# EAGLE design OneDigitDisplay (EAGLE 9.6.2)
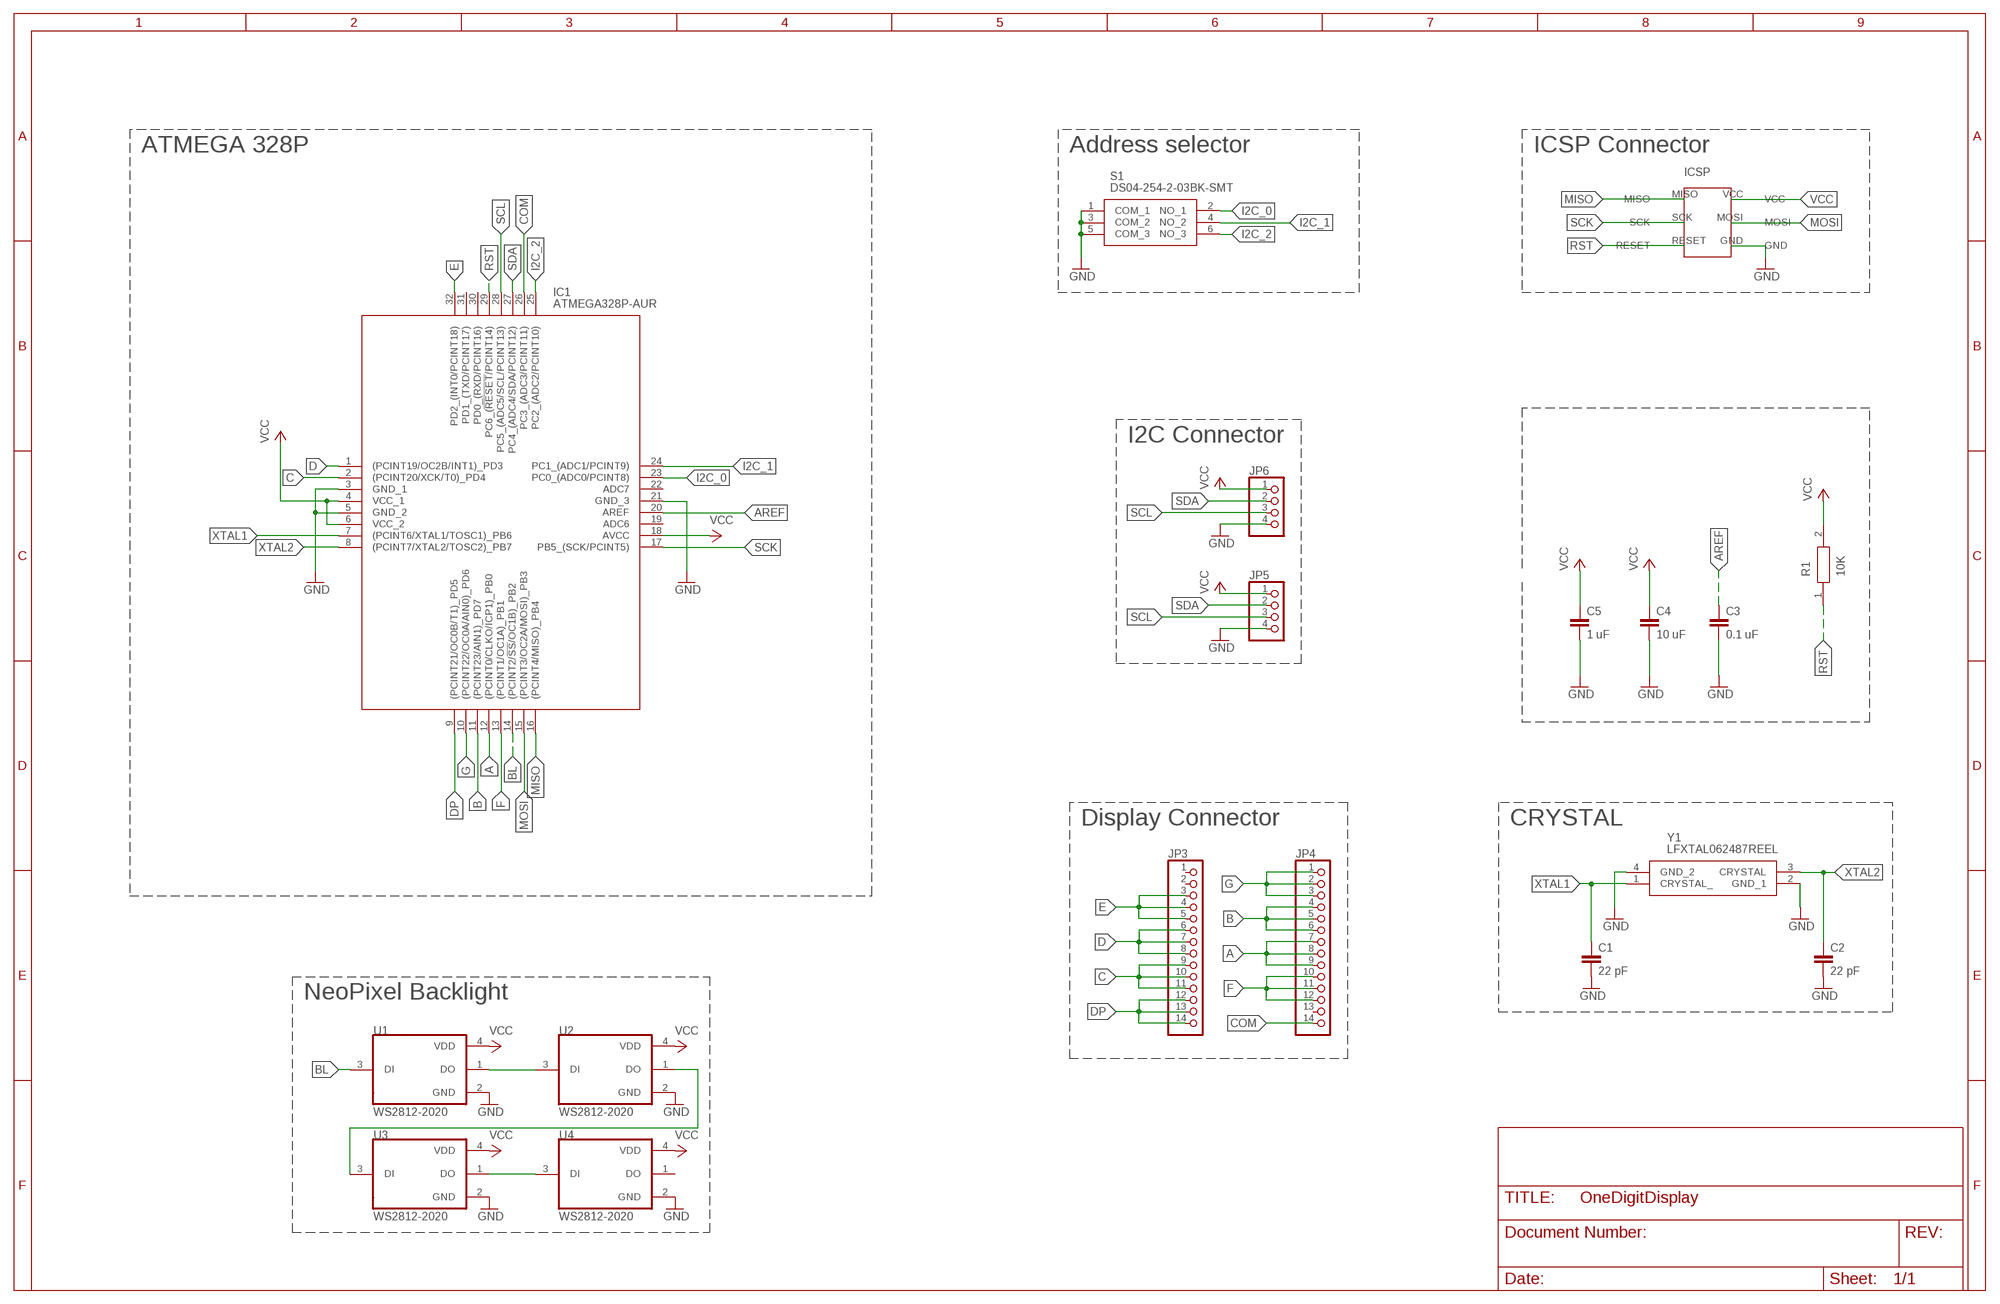
[diagram p0: schematic, sheet 1]

## Parts
C1  22 pF  C-EUC0603K  [C0603K]
C2  22 pF  C-EUC0603K  [C0603K]
C3  0.1 uF  C-EUC0603  [C0603]
C4  10 uF  C-EUC0603  [C0603]
C5  1 uF  C-EUC0603  [C0603]
IC1  ATMEGA328P-AUR  [QFP80P900X900X120-32N]
JP3  PINHD-1X14  [1X14]
JP4  PINHD-1X14  [1X14]
JP5  PINHD-1X4  [1X04]
JP6  PINHD-1X4  [1X04]
R1  10K  TNPW060330K0BXEA  [RESC1608X55N]
S1  DS04-254-2-03BK-SMT  [DS04254203BKSMT]
U1  WS2812-2020  [LED_WS2812-2020]
U2  WS2812-2020  [LED_WS2812-2020]
U3  WS2812-2020  [LED_WS2812-2020]
U4  WS2812-2020  [LED_WS2812-2020]
U$1  6PINICSP  [6PINICSP]
Y1  LFXTAL062487REEL  [LFXTAL062487REEL]

## Nets
A: IC1.12((PCINT0/CLKO/ICP1)_PB0) JP4.7 JP4.8 JP4.9
AREF: C3.1 IC1.20(AREF)
B: IC1.11((PCINT23/AIN1)_PD7) JP4.4 JP4.5 JP4.6
BL: IC1.14((PCINT2/!SS!/OC1B)_PB2) U1.3(DI)
C: IC1.2((PCINT20/XCK/T0)_PD4) JP3.9 JP3.10 JP3.11
COM: IC1.26(PC3_(ADC3/PCINT11)) JP4.14
D: IC1.1((PCINT19/OC2B/INT1)_PD3) JP3.6 JP3.7 JP3.8
DP: IC1.9((PCINT21/OC0B/T1)_PD5) JP3.12 JP3.13 JP3.14
E: IC1.32(PD2_(INT0/PCINT18)) JP3.3 JP3.4 JP3.5
F: IC1.13((PCINT1/OC1A)_PB1) JP4.10 JP4.11 JP4.12
G: IC1.10((PCINT22/OC0A/AIN0)_PD6) JP4.1 JP4.2 JP4.3
GND: C1.2 C2.2 C3.2 C4.2 C5.2 IC1.3(GND_1) IC1.5(GND_2) IC1.21(GND_3) JP5.4 JP6.4 S1.1(COM_1) S1.3(COM_2) S1.5(COM_3) U1.2(GND) U2.2(GND) U3.2(GND) U4.2(GND) U$1.GND Y1.2(GND_1) Y1.4(GND_2)
I2C_0: IC1.23(PC0_(ADC0/PCINT8)) S1.2(NO_1)
I2C_1: IC1.24(PC1_(ADC1/PCINT9)) S1.4(NO_2)
I2C_2: IC1.25(PC2_(ADC2/PCINT10)) S1.6(NO_3)
MISO: IC1.16((PCINT4/MISO)_PB4) U$1.MISO
MOSI: IC1.15((PCINT3/OC2A/MOSI)_PB3) U$1.MOSI
N$1: U1.1(DO) U2.3(DI)
N$2: U2.1(DO) U3.3(DI)
N$3: U3.1(DO) U4.3(DI)
RST: IC1.29(PC6_(!RESET!/PCINT14)) R1.1 U$1.RESET
SCK: IC1.17(PB5_(SCK/PCINT5)) U$1.SCK
SCL: IC1.28(PC5_(ADC5/SCL/PCINT13)) JP5.3 JP6.3
SDA: IC1.27(PC4_(ADC4/SDA/PCINT12)) JP5.2 JP6.2
VCC: C4.1 C5.1 IC1.4(VCC_1) IC1.6(VCC_2) IC1.18(AVCC) JP5.1 JP6.1 R1.2 U1.4(VDD) U2.4(VDD) U3.4(VDD) U4.4(VDD) U$1.VCC
XTAL1: C1.1 IC1.7((PCINT6/XTAL1/TOSC1)_PB6) Y1.1(CRYSTAL_)
XTAL2: C2.1 IC1.8((PCINT7/XTAL2/TOSC2)_PB7) Y1.3(CRYSTAL)
Unconnected: IC1.19(ADC6) IC1.22(ADC7) IC1.30(PD0_(RXD/PCINT16)) IC1.31(PD1_(TXD/PCINT17)) JP3.1 JP3.2 JP4.13 U4.1(DO)

## Notes on the sheet
- ATMEGA 328P | Address selector | ICSP Connector
- I2C Connector
- Display Connector | CRYSTAL
- NeoPixel Backlight

## Library data of the parts
C1-C5 = rcl:C-EU: CAPACITOR, European symbol; SPICEPREFIX: C
IC1 = ATMEGA328P-AUR:ATMEGA328P-AUR: 8-bit Microcontrollers - MCU AVR 32K FLSH 2K SRAM 1KB EE-20MHz IND Source: Datasheet; DESCRIPTION: 8-bit Microcontrollers - MCU AVR 32K FLSH 2K SRAM 1KB EE-20MHz IND; HEIGHT: 1.2mm; MANUFACTURER_NAME: Microchip; MANUFACTURER_PART_NUMBER: ATMEGA328P-AUR; MOUSER_PART_NUMBER: 556-ATMEGA328P-AUR; MOUSER_PRICE-STOCK: https://www.mouser.co.uk/ProductDetail/Microchip-Technology/ATMEGA328P-AUR?qs=6Dg1WZIWLC4z32PdFaWSBQ%3D%3D
JP3 JP4 = adafruit:PINHD-1X14: PIN HEADER; SPICEPREFIX: X
JP5 JP6 = pinhead:PINHD-1X4: PIN HEADER
R1 = TNPW060330K0BXEA:TNPW060330K0BXEA: Thin Film Resistors - SMD TNPW0603 30K 0.1% T-10 ET1 e3 Source: Datasheet; DESCRIPTION: Thin Film Resistors - SMD TNPW0603 30K 0.1% T-10 ET1 e3; HEIGHT: 0.55mm; MANUFACTURER_NAME: Vishay; MANUFACTURER_PART_NUMBER: TNPW060330K0BXEA; MOUSER_PART_NUMBER: 71-TNPW060330K0BXEA; MOUSER_PRICE-STOCK: https://www.mouser.co.uk/ProductDetail/Vishay/TNPW060330K0BXEA?qs=vmHwEFxEFR%252BodANPEwSK8w%3D%3D
S1 = DS04-254-2-03BK-SMT:DS04-254-2-03BK-SMT: DIP Switches / SIP Switches DIP Switch, SPST, 2.54 pitch, flat actuator, SMT, 3 position, Black Source: Datasheet <https://datasheet.datasheetarchive.com/originals/distributors/Datasheets_SAMA/c6ff744c627a82ac82db8ce1595a468c.pdf>; DESCRIPTION: DIP Switches / SIP Switches DIP Switch, SPST, 2.54 pitch, flat actuator, SMT, 3 position, Black; HEIGHT: 4.3mm; MANUFACTURER_NAME: CUI Devices; MANUFACTURER_PART_NUMBER: DS04-254-2-03BK-SMT; MOUSER_PART_NUMBER: 490-DS04254203BK-SMT; MOUSER_PRICE-STOCK: https://www.mouser.co.uk/ProductDetail/CUI-Devices/DS04-254-2-03BK-SMT?qs=wnTfsH77Xs6HyisDGRVjIg%3D%3D
U1-U4 = WS2812-2020:WS2812-2020: Check availability <https://pricing.snapeda.com/parts/WS2812-2020/Worldsemi/view-part?ref=eda>; AVAILABILITY: Not in stock; DESCRIPTION: Intelligent control LED light source, SMD-4; MF: Worldsemi; MP: WS2812-2020; PACKAGE: Package; PRICE: None
U$1 = 6PINICSP:6PINICSP
Y1 = LFXTAL062487Reel:LFXTAL062487REEL: Crystals 16MHz 22pF -10C 60C Source: Datasheet <https://www.iqdfrequencyproducts.com/products/pn/LFXTAL062487Reel.pdf>; DESCRIPTION: Crystals 16MHz 22pF -10C 60C; HEIGHT: 0.6mm; MANUFACTURER_NAME: IQD; MANUFACTURER_PART_NUMBER: LFXTAL062487Reel; MOUSER_PART_NUMBER: 449-LFXTAL062487REEL; MOUSER_PRICE-STOCK: https://www.mouser.co.uk/ProductDetail/IQD/LFXTAL062487Reel?qs=e4%2FAndAAwgKTrG0QMc3CnQ%3D%3D

## Board
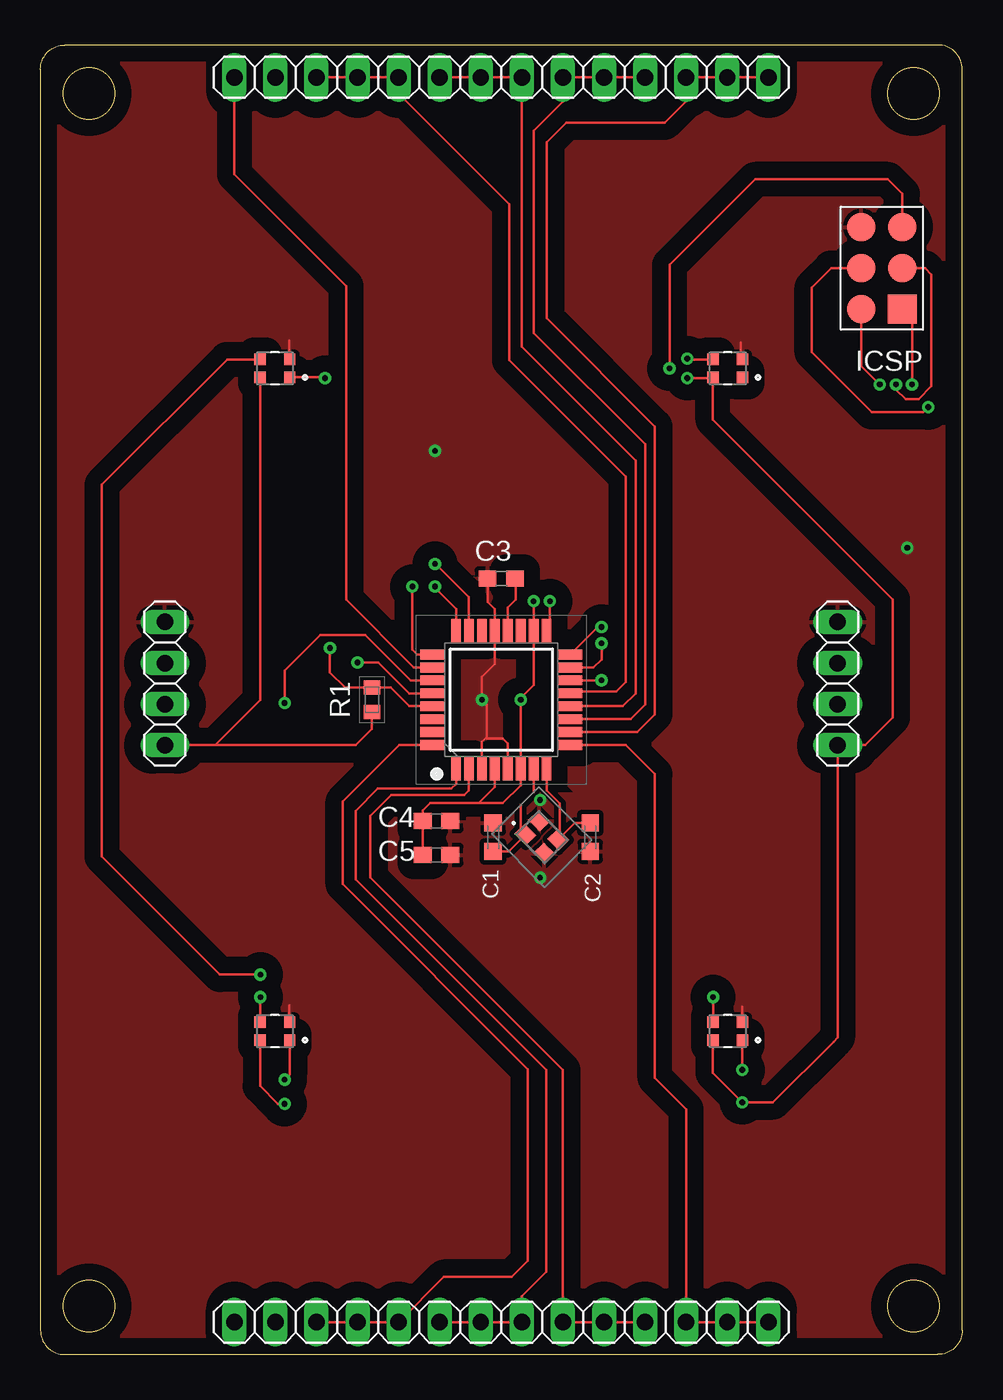
[diagram p1: board, top side]
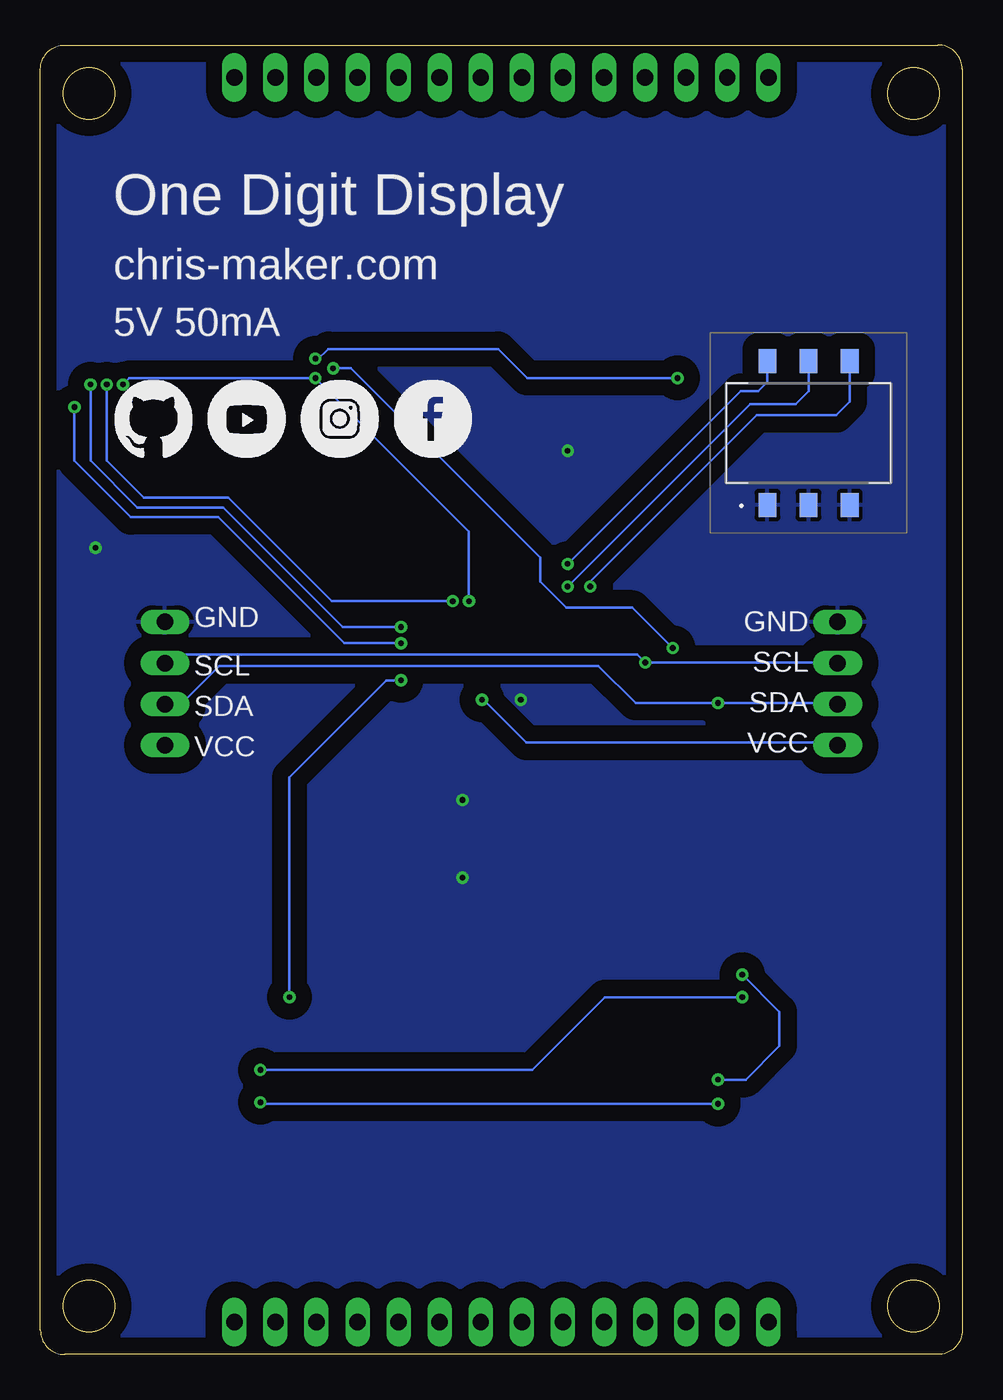
[diagram p2: board, bottom side, seen from below]

Size 57 x 81 mm. Coordinates in mm from the lower left corner, seen from the top.
Outline: 1.5,0 55.5,0 arc90 57,1.5 57,79.5 arc90 55.5,81 1.5,81 arc90 0,79.5 0,1.5 arc90 1.5,0
Outline: circle at 54,3 radius 1.6
Outline: circle at 3,3 radius 1.6
Outline: circle at 3,78 radius 1.6
Outline: circle at 54,78 radius 1.6
Copper layers (1*16): Top 0.035mm / dielectric 1.5mm / Bottom 0.035mm
Design rules "default": minimum track width 6mil, minimum drill 0.35mm, track to track 6mil, track to pad 6mil, pad to pad 6mil, via to via 6mil, smd to smd 6mil, copper to edge 40mil, drill to drill 6mil, minimum pad ring 10mil, minimum via ring 8mil, stop-mask expansion 4mil, vias tented up to drill 0mil, thermal gap 10mil

### Footprints (pad centres in the part's own frame; a part is rotated, then mirrored left to right if it is on the bottom)
C0603K = smd 1.05 x 1.08: 1 -0.875,0; 2 0.875,0
C0603 = smd 1.1 x 1: 1 -0.85,0; 2 0.85,0
QFP80P900X900X120-32N = smd 1.5 x 0.6: 1 -4.25,2.8; 2 -4.25,2; 3 -4.25,1.2; 4 -4.25,0.4; 5 -4.25,-0.4; 6 -4.25,-1.2; 7 -4.25,-2; 8 -4.25,-2.8; 17 4.25,-2.8; 18 4.25,-2; 19 4.25,-1.2; 20 4.25,-0.4; 21 4.25,0.4; 22 4.25,1.2; 23 4.25,2; 24 4.25,2.8 | smd 0.6 x 1.5: 9 -2.8,-4.25; 10 -2,-4.25; 11 -1.2,-4.25; 12 -0.4,-4.25; 13 0.4,-4.25; 14 1.2,-4.25; 15 2,-4.25; 16 2.8,-4.25; 25 2.8,4.25; 26 2,4.25; 27 1.2,4.25; 28 0.4,4.25; 29 -0.4,4.25; 30 -1.2,4.25; 31 -2,4.25; 32 -2.8,4.25
1X14 = drill 1.016 long: 1 -16.51,0; 2 -13.97,0; 3 -11.43,0; 4 -8.89,0; 5 -6.35,0; 6 -3.81,0; 7 -1.27,0; 8 1.27,0; 9 3.81,0; 10 6.35,0; 11 8.89,0; 12 11.43,0; 13 13.97,0; 14 16.51,0
1X04 = drill 1.016 long: 1 -3.81,0; 2 -1.27,0; 3 1.27,0; 4 3.81,0
RESC1608X55N = smd 0.85 x 1: 1 -0.75,0; 2 0.75,0
DS04254203BKSMT = smd 1.1 x 1.5: 1 -2.54,-4.45; 2 -2.54,4.45; 3 0,-4.45; 4 0,4.45; 5 2.54,-4.45; 6 2.54,4.45
LED_WS2812-2020 = smd 0.7 x 0.7: 1 0.915,-0.55; 2 0.915,0.55; 3 -0.915,0.55; 4 -0.915,-0.55
6PINICSP = smd 1.778 x 1.778: GND 2.54,2.54; MISO -2.54,0; MOSI 0,2.54; RESET 2.54,0; SCK 0,0; VCC -2.54,2.54
LFXTAL062487REEL = smd 1 x 0.9: 1 -0.825,-0.613; 2 0.825,-0.613; 3 0.825,0.613; 4 -0.825,0.613

### Placement (x,y rotation side)
C1  28,32 90 top
C2  34,32 270 top
C3  28.5,48 180 top
C4  24.5,33 0 top
C5  24.5,30.9 0 top
IC1  28.5,40.5 90 top
JP3  28.5,2 0 top
JP4  28.5,79 180 top
JP5  7.7,41.5 90 top
JP6  49.3,41.5 90 top
R1  20.5,40.5 270 top
S1  9.5,57 0 bottom
U1  42.5,20 0 top
U2  14.5,20 0 top
U3  14.5,61 0 top
U4  42.5,61 0 top
U$1  53.3,67.2 90 top
Y1  31,32 315 top

### Tracks (layer width: path | path; a pad name or v marks a point on that pad's centre or on a via)
A
  Top 0.152: JP4.9 JP4.8 JP4.7 29.77,62.33 36.8,55.3 36.8,40.9 36,40.1 IC1.12
AREF
  Top 0.152: C3.1 29.4,47.95 29.4,46.7 28.9,46.2 IC1.20
B
  Top 0.152: JP4.4 JP4.5 JP4.6 32.31,77.5 30.51,75.7 30.51,63.19 37.4,56.3 37.4,40.2 36.5,39.3 IC1.11
BL  (via drill 0.35)
  Top 0.152: v34.7,41.7 IC1.14 | v41.6,22.1 41.6,20.57 U1.3
  Bottom 0.152: v34.7,41.7 35.6,41.7 41.6,35.7 v41.6,22.1
C
  Top 0.152: IC1.2 26.5,34.9 26.2,34.6 21.7,34.6 20.4,33.3 20.4,29.5 32.31,17.59 JP3.9 JP3.10 JP3.11
COM
  Top 0.152: IC1.26 23.1,42.5 18.9,46.7 18.9,66.1 12,73 JP4.14
D
  Top 0.152: JP3.6 JP3.7 JP3.8 29.77,3.6 31.27,5.1 31.27,17.6 19.5,29.38 19.5,33.63 20.87,35.01 25.41,35.01 25.7,35.3 IC1.1
DP
  Top 0.152: JP3.14 JP3.13 JP3.12 39.93,15.17 38,17.1 38,35.9 36.2,37.7 IC1.9
E
  Top 0.152: JP3.3 JP3.4 JP3.5 24.95,4.8 29.15,4.8 30.15,5.8 30.15,17.65 18.7,29.1 18.7,34.2 22.2,37.7 IC1.32
F
  Top 0.152: JP4.12 JP4.11 JP4.10 22.15,78 29,71.15 29,61.5 36.2,54.3 36.2,41.6 35.6,41 32.85,41 IC1.13
G
  Top 0.152: JP4.1 JP4.2 JP4.3 39.93,77.53 38.6,76.2 32.5,76.2 31.3,75 31.3,64.1 38,57.4 38,39.6 36.9,38.5 IC1.10
GND  (via drill 0.35)
  Top 0.152: C3.2 27.65,46.55 28.1,46.1 IC1.21 28.1,42.7 27.3,41.9 v27.3,40.5 27.6,40.2 27.6,38.2 | IC1.5 28.9,37.8 28.6,38.1 27.6,38.1 27.6,38.2 | 27.6,38.2 27.3,37.9 IC1.3 | U3.2 15.4,61.56 15.4,62.7 | U2.2 15.4,20.57 15.4,21.6 | U1.2 43.4,20.57 43.4,21.5 | U4.2 43.3,61.66 43.3,62.6
  other vias: 30.9,34.3 30.9,29.5 53.6,49.9 24.4,55.9
  pour Top (isolate 1): -0.8,82 -0.8,-1 58,-1 58,82
  pour Bottom (isolate 1): -2.1,83 -2.1,-2 59,-2 59,83
  pour Top (isolate 0.3): 26.4,30.2 26.4,33.2 28.9,33.2 30.4,34.7 35.6,34.7 36.4,33.9 36.4,30.4 34.5,28.5 28.1,28.5
I2C_0  (via drill 0.35)
  Top 0.152: v24.4,48.9 24.45,48.9 26.5,46.85 IC1.23
  Bottom 0.152: v24.4,48.9 13.7,59.6 12.6,59.6 12.04,60.16 S1.2
I2C_1  (via drill 0.35)
  Top 0.152: v24.4,47.5 24.4,47.4 25.7,46.1 IC1.24
  Bottom 0.152: v24.4,47.5 13.1,58.8 10.3,58.8 9.5,59.6 S1.4
I2C_2  (via drill 0.35)
  Top 0.152: IC1.25 23.3,43.3 23,43.6 v23,47.5
  Bottom 0.152: v23,47.5 23,47.8 12.7,58.1 7.8,58.1 6.96,58.94 S1.6
MISO  (via drill 0.35)
  Top 0.152: IC1.16 34.45,45 v34.7,45 | v53.9,60 53.9,64.06 U$1.MISO
  Bottom 0.152: v34.7,45 38.3,45 45.7,52.4 51,52.4 53.9,55.3 v53.9,60
MOSI  (via drill 0.35)
  Top 0.152: IC1.15 34.2,42.5 34.7,43 v34.7,44 | v54.9,58.6 54.6,58.3 51.4,58.3 47.7,62 47.7,66 48.9,67.2 U$1.MOSI
  Bottom 0.152: v34.7,44 38.2,44 46,51.8 51.4,51.8 54.9,55.3 v54.9,58.6
N$1  (via drill 0.35)
  Top 0.152: v43.4,17.6 43.4,19.43 U1.1 | U2.3 13.59,22.09 v13.6,22.1
  Bottom 0.152: v13.6,22.1 22.1,22.1 26.6,17.6 v43.4,17.6
N$2  (via drill 0.35)
  Top 0.152: U3.3 11.55,61.55 3.8,53.8 3.8,30.8 11.1,23.5 v13.6,23.5 | U2.1 15.41,17.32 v15.1,17
  Bottom 0.152: v15.1,17 13.4,17 11.3,19.1 11.3,21.2 v13.6,23.5
N$3  (via drill 0.35)
  Top 0.152: U3.1 17.55,60.45 v17.6,60.4 | U4.3 40.05,61.55 v40,61.6
  Bottom 0.152: v40,61.6 39.9,61.5 39.2,62.2 28.7,62.2 26.9,60.4 v17.6,60.4
RST  (via drill 0.35)
  Top 0.152: IC1.29 22.8,40.1 21.65,41.25 R1.1 18.85,41.25 17.9,42.2 v17.9,43.7 | U$1.RESET 53.3,71.8 52.4,72.7 44.2,72.7 38.9,67.4 v38.9,61
  Bottom 0.152: v17.9,43.7 20.4,46.2 24.5,46.2 26.1,47.8 26.1,49.3 37.8,61 v38.9,61
SCK  (via drill 0.35)
  Top 0.152: IC1.17 31.5,44.95 v31.5,46.6 | v52.9,60 52.9,59.7 53.5,59.1 54.3,59.1 55.1,59.9 55.1,66.8 54.7,67.2 U$1.SCK
  Bottom 0.152: v31.5,46.6 39,46.6 45.4,53 50.6,53 52.9,55.3 v52.9,60
SCL  (via drill 0.35)
  Top 0.152: IC1.28 22.8,40.9 20.9,42.8 v19.6,42.8
  Bottom 0.152: JP5.3 7.7,42.8 v19.6,42.8 20.1,43.3 49.3,43.3 JP6.3
SDA  (via drill 0.35)
  Top 0.152: IC1.27 22.9,41.7 20.1,44.5 17.3,44.5 15.1,42.3 v15.1,40.3
  Bottom 0.152: JP5.2 7.7,40.3 v15.1,40.3 20.2,40.3 22.5,42.6 45.94,42.6 48.12,40.42 49.3,40.42 JP6.2
VCC  (via drill 0.35)
  Top 0.152: 27.1,34.1 28.6,34.1 29.7,35.2 IC1.6 v29.7,40.5 29.7,40.6 30.5,41.4 IC1.18 v30.5,46.6 | 27.1,34.1 24.1,34.1 23.65,33.65 C4.1 C5.1 | IC1.4 28.1,35.1 27.1,34.1 | R1.2 20.5,38.7 19.49,37.69 10.8,37.69 10.8,37.7 | 41.59,60.4 41.59,57.81 52.7,46.7 52.7,39.4 50.99,37.69 JP6.1 49.3,19.6 49.05,19.35 45.3,15.6 v43.4,15.6 41.59,17.41 U1.4 | 41.59,60.4 U4.4 | U3.4 13.59,40.48 10.8,37.7 | U2.4 13.59,16.6 14.69,15.5 v15.1,15.5 | v40,60.4 41.59,60.4 | v51.9,60 50.76,61.14 U$1.VCC | JP5.1 10.8,37.7
  Bottom 0.152: v29.7,40.5 29.6,40.5 26.95,37.85 7.86,37.85 JP5.1 | v15.1,15.5 43.3,15.5 v43.4,15.6 | v30.5,46.6 30.5,50.9 v40,60.4 51.5,60.4 v51.9,60
XTAL1
  Top 0.152: IC1.7 30.5,34.8 29.7,34 29.7,32.43 Y1.1 28.96,31.12 C1.1
XTAL2
  Top 0.152: IC1.8 31.3,34.9 32.12,34.08 32.12,31.95 Y1.3 33.04,32.88 C2.1

### Text on the board
bPlace: GND | GND | SCL | SCL | SDA | SDA | VCC | VCC
bNames: One Digit Display | chris-maker.com | 5V 50mA